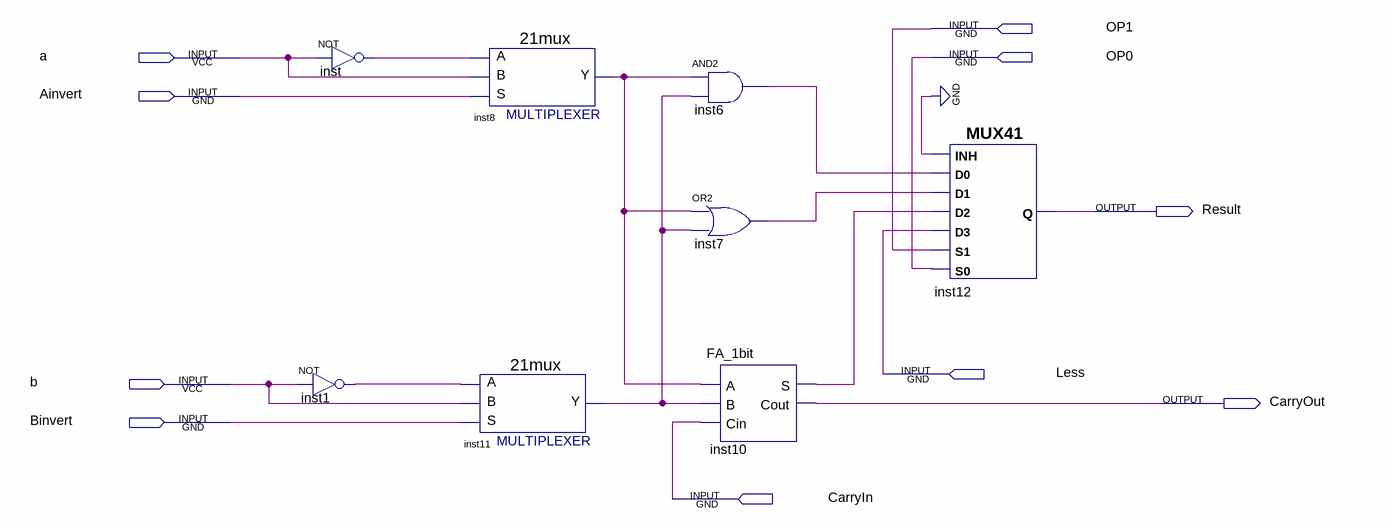
[diagram p0: schematic sheet]
// Quartus schematic ULA1.bdf as structural Verilog: 8 symbols, 10 pins
module ULA1 (
  input  OP1,
  input  a,
  input  OP0,
  input  Ainvert,
  input  Less,
  input  b,
  input  Binvert,
  input  CarryIn,
  output Result,
  output CarryOut
);

  wire inst1_out, inst6_out, inst7_out, inst8_y, inst10_s, inst11_y, inst_out;

  not inst (inst_out, a);
  not inst1 (inst1_out, b);
  \21mux  inst8 (.S(Ainvert), .B(a), .A(inst_out), .Y(inst8_y));
  \21mux  inst11 (.S(Binvert), .B(b), .A(inst1_out), .Y(inst11_y));
  and inst6 (inst6_out, inst8_y, inst11_y);
  or inst7 (inst7_out, inst8_y, inst11_y);
  FA_1bit inst10 (.A(inst8_y), .B(inst11_y), .Cin(CarryIn), .S(inst10_s), .Cout(CarryOut));
  MUX41 inst12 (.S0(OP0), .D2(inst10_s), .S1(OP1), .D3(Less), .D0(inst6_out), .INH(1'b0), .D1(inst7_out), .Q(Result));
endmodule
